# EAGLE schematic Main (EAGLE 9.5.2)
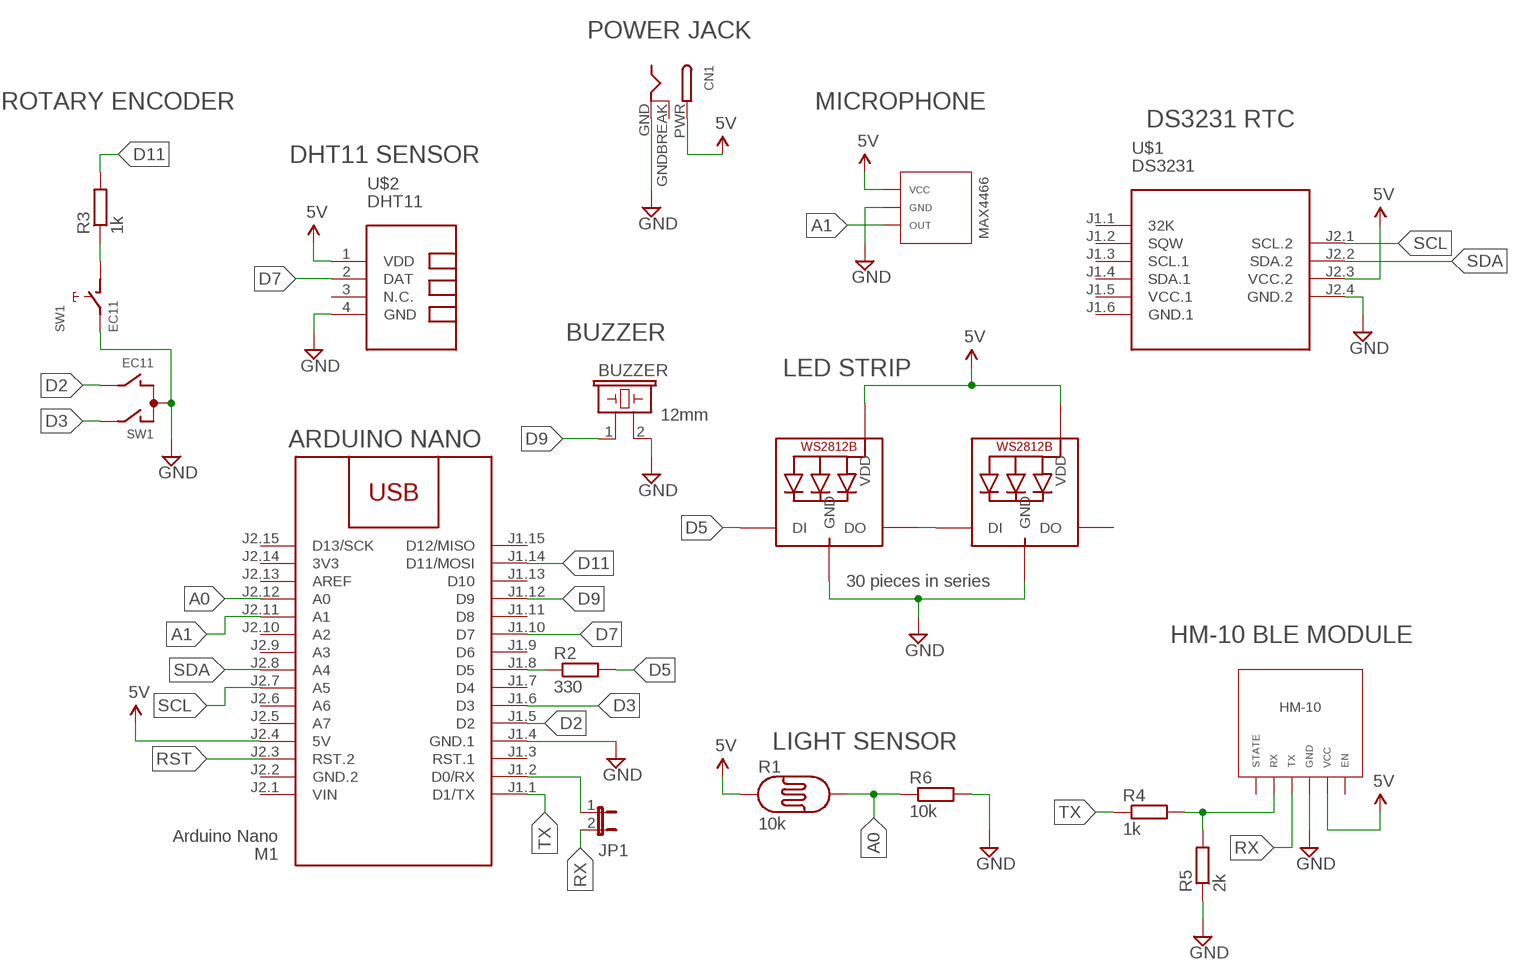
[diagram p0: schematic, sheet 1]

## Parts
BUZZER  12mm  B/C17S  [B/C17S]
CN1  DCBARRELPTH  [DCJACK_2MM_PTH]
JP1  JP1E  [JP1]
LED1  30 in total  WS2812B_5050N  [WS2812B-NARROW]
LED3  30 in total  WS2812B_5050N  [WS2812B-NARROW]
M1  Arduino Nano  ARDUINO-NANO-3.0  [ARDUINO-NANO-3.0]
R1  10k  PHOTOCELLPTH  [PHOTOCELL]
R2  330  R-EU_0207/10  [0207/10]
R3  1k  R-EU_0207/10  [0207/10]
R4  1k  R-EU_0207/12  [0207/12]
R5  2k  R-EU_0207/12  [0207/12]
R6  10k  R-EU_0207/10  [0207/10]
SW1  EC11  EC12E_SW  [ALPS_EC12E_SW]
U$1  DS3231  RTC-DS3231-AT24C32  [RTC-DS3231-AT24C32]
U$2  DHT11  TEMP-HUM-SENSOR-DHT11  [TEMP-HUM-SENSOR-DHT11]

## Nets
A0: M1.J2.12(A0) R1.2 R6.1
A1: M1.J2.11(A1)
D2: M1.J1.5(D2) SW1.B
D3: M1.J1.6(D3) SW1.A
D5: LED3.4-DIN(DI) R2.2
D7: M1.J1.10(D7) U$2.2(DAT)
D9: BUZZER.1 M1.J1.12(D9)
D11: M1.J1.14(D11/MOSI) R3.2
GND: CN1.GND LED1.3-GND(GND) LED3.3-GND(GND) M1.J1.4(GND.1) R5.1 R6.2 SW1.C SW1.E U$1.J2.4(GND.2) U$2.4(GND)
N$1: M1.J1.8(D5) R2.1
N$2: R3.1 SW1.D
N$3: BUZZER.2 ; supply symbol labelled GND
NEXT: LED1.4-DIN(DI) LED3.2-DOUT(DO)
RST: M1.J2.3(RST.2)
RX: JP1.1 JP1.2 M1.J1.2(D0/RX)
SCL: M1.J2.7(A5) U$1.J2.1(SCL.2)
SDA: M1.J2.8(A4) U$1.J2.2(SDA.2)
TX: M1.J1.1(D1/TX) R4.1 R4.2 R5.2
VCC: CN1.PWR LED1.1-VDD(VDD) LED3.1-VDD(VDD) M1.J2.4(5V) R1.1 U$1.J2.3(VCC.2) U$2.1(VDD) ; supply symbol labelled 5V
Unconnected: LED1.2-DOUT(DO) M1.J1.3(RST.1) M1.J1.7(D4) M1.J1.9(D6) M1.J1.11(D8) M1.J1.13(D10) M1.J1.15(D12/MISO) M1.J2.5(A7) M1.J2.6(A6) M1.J2.9(A3) M1.J2.10(A2) M1.J2.13(AREF) M1.J2.15(D13/SCK) SW1.GND1(G) SW1.GND2(G) U$1.J1.1(32K) U$1.J1.2(SQW) U$1.J1.3(SCL.1) U$1.J1.4(SDA.1) U$2.3(N.C.)

## Notes on the sheet
- POWER JACK
- ROTARY ENCODER | MICROPHONE
- DS3231 RTC
- DHT11 SENSOR
- VCC
- GND | MAX4466
- OUT
- BUZZER
- LED STRIP
- ARDUINO NANO
- 30 pieces in series
- HM-10 BLE MODULE
- HM-10
- LIGHT SENSOR
- STATE | RX | TX | GND | VCC | EN

## Power pins joined to a net without a drawn wire
3V3: M1.J2.14(3V3)
GND.1: U$1.J1.6(GND.1)
GND.2: M1.J2.2(GND.2)
GNDBREAK: CN1.GNDBREAK
VCC.1: U$1.J1.5(VCC.1)
VIN: M1.J2.1(VIN)

## Library data of the parts
BUZZER = buzzer:B/C17S: BUZZER Source: Buerklin; OC_FARNELL: unknown; OC_NEWARK: unknown
CN1 = adafruit:DCBARREL: 2.0mm DC Barrel Jack DCJACK_2MM_PTH - Through Hole Jack (4UConnector: 05537)
JP1 = jumper:JP1E: JUMPER
LED1 LED3 = adafruit:WS2812B
M1 = diy-modules:ARDUINO-NANO-3.0: Arduino Nano 3.0 and compatible devices More details available here: https://www.arduino.cc/en/Main/ArduinoBoardNano Click here to find device on ebay.com <http://www.ebay.com/sch/arduino+nano>
R1 = SparkFun-Sensors:PHOTOCELL: Photocell (Photodetector, Photo Resistor, CdS) This is a very small light sensor. A photocell changes (also called a photodetector, photo resistor, CdS or photoconductive cell) resistance depending on the amount of light it is exposed to. These little sensors make great ambient light triggers (when light in the room turns on, do something). Datasheet <http://cdn.sparkfun.com/datasheets/Sensors/LightImaging/SEN-09088.pdf> SparkFun Products Mini Photocell <https://www.sparkfun.com/products/9088> (SEN-09088); PROD_ID: COMP-09129; SF_ID: SEN-09088
R2 R4 R5 = rcl:R-EU_: RESISTOR, European symbol; SPICEPREFIX: R
R3 R6 = resistor:R-EU_: RESISTOR, European symbol
SW1 = switch-alps:EC12E_SW: ALPS rotary Encoder EC12E series with switch; MPN: EC12E2424407; OC_FARNELL: 1520813; OC_NEWARK: 74M1068
U$1 = diy-modules:RTC-DS3231-AT24C32: RTC Module with Battery and EEPROM based on DS3231 and AT24C32 chips Tutorial can be found here: https://edwardmallon.wordpress.com/2014/05/21/using-a-cheap-3-ds3231-rtc-at24c32-eeprom-from-ebay/ Click here to find device on ebay.com <http://www.ebay.com/sch/DS3231+AT24C32+module>
U$2 = diy-modules:TEMP-HUM-SENSOR-DHT11: DHT11 - digital humidity & temperature sensor DHT11 datasheet available here: https://akizukidenshi.com/download/ds/aosong/DHT11.pdf Click here to find device on ebay.com <http://www.ebay.com/sch/dht11+digital+sensor>